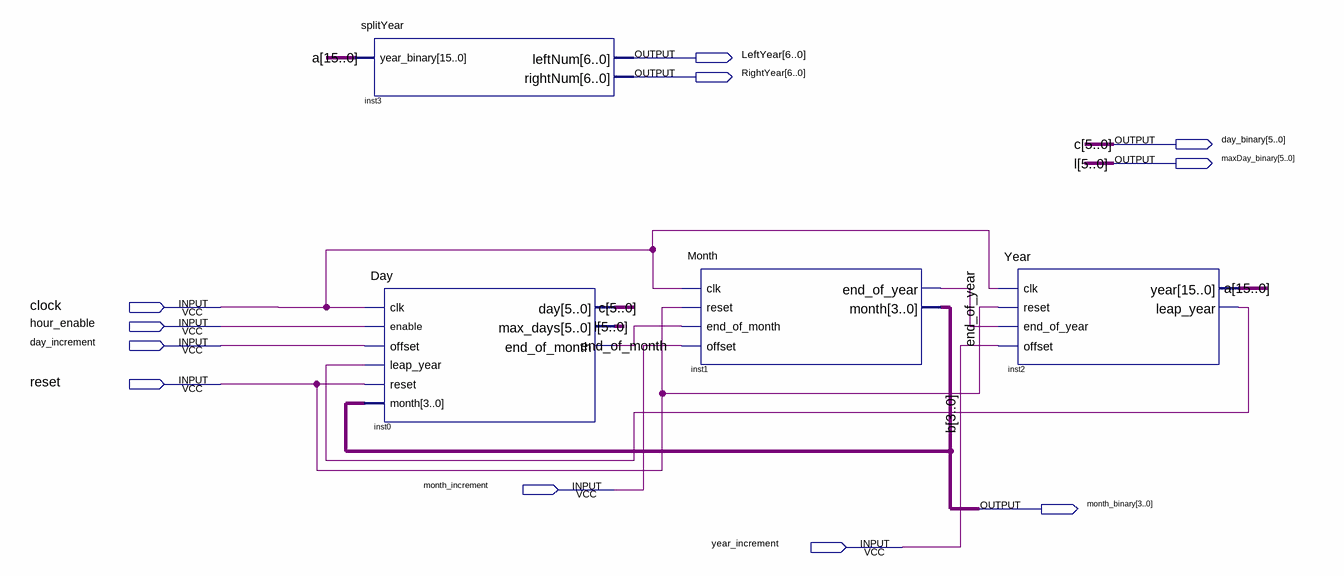
[diagram p0: schematic sheet]
// Quartus schematic calendar4.bdf as structural Verilog: 4 symbols, 11 pins
module calendar4 (
  input  clock,
  input  hour_enable,
  input  day_increment,
  input  reset,
  input  month_increment,
  input  year_increment,
  output [6:0] LeftYear,
  output [6:0] RightYear,
  output [5:0] day_binary,
  output [5:0] maxDay_binary,
  output [3:0] month_binary
);

  wire end_of_month, end_of_year, inst2_leap_year;
  wire [15:0] a;

  splitYear inst3 (.year_binary(a), .leftNum(LeftYear), .rightNum(RightYear));
  Day inst0 (
    .clk(clock), .enable(hour_enable), .offset(day_increment), .leap_year(inst2_leap_year), .reset(reset),
    .month(month_binary), .day(day_binary), .max_days(maxDay_binary), .end_of_month(end_of_month));
  Month inst1 (
    .clk(clock), .reset(reset), .end_of_month(end_of_month), .offset(month_increment),
    .end_of_year(end_of_year), .month(month_binary));
  Year inst2 (
    .clk(clock), .reset(reset), .end_of_year(end_of_year), .offset(year_increment), .year(a),
    .leap_year(inst2_leap_year));

  // Other names for the same wires on the sheet: b[3:0] = month_binary; c[5:0] = day_binary; l[5:0] = maxDay_binary
endmodule
